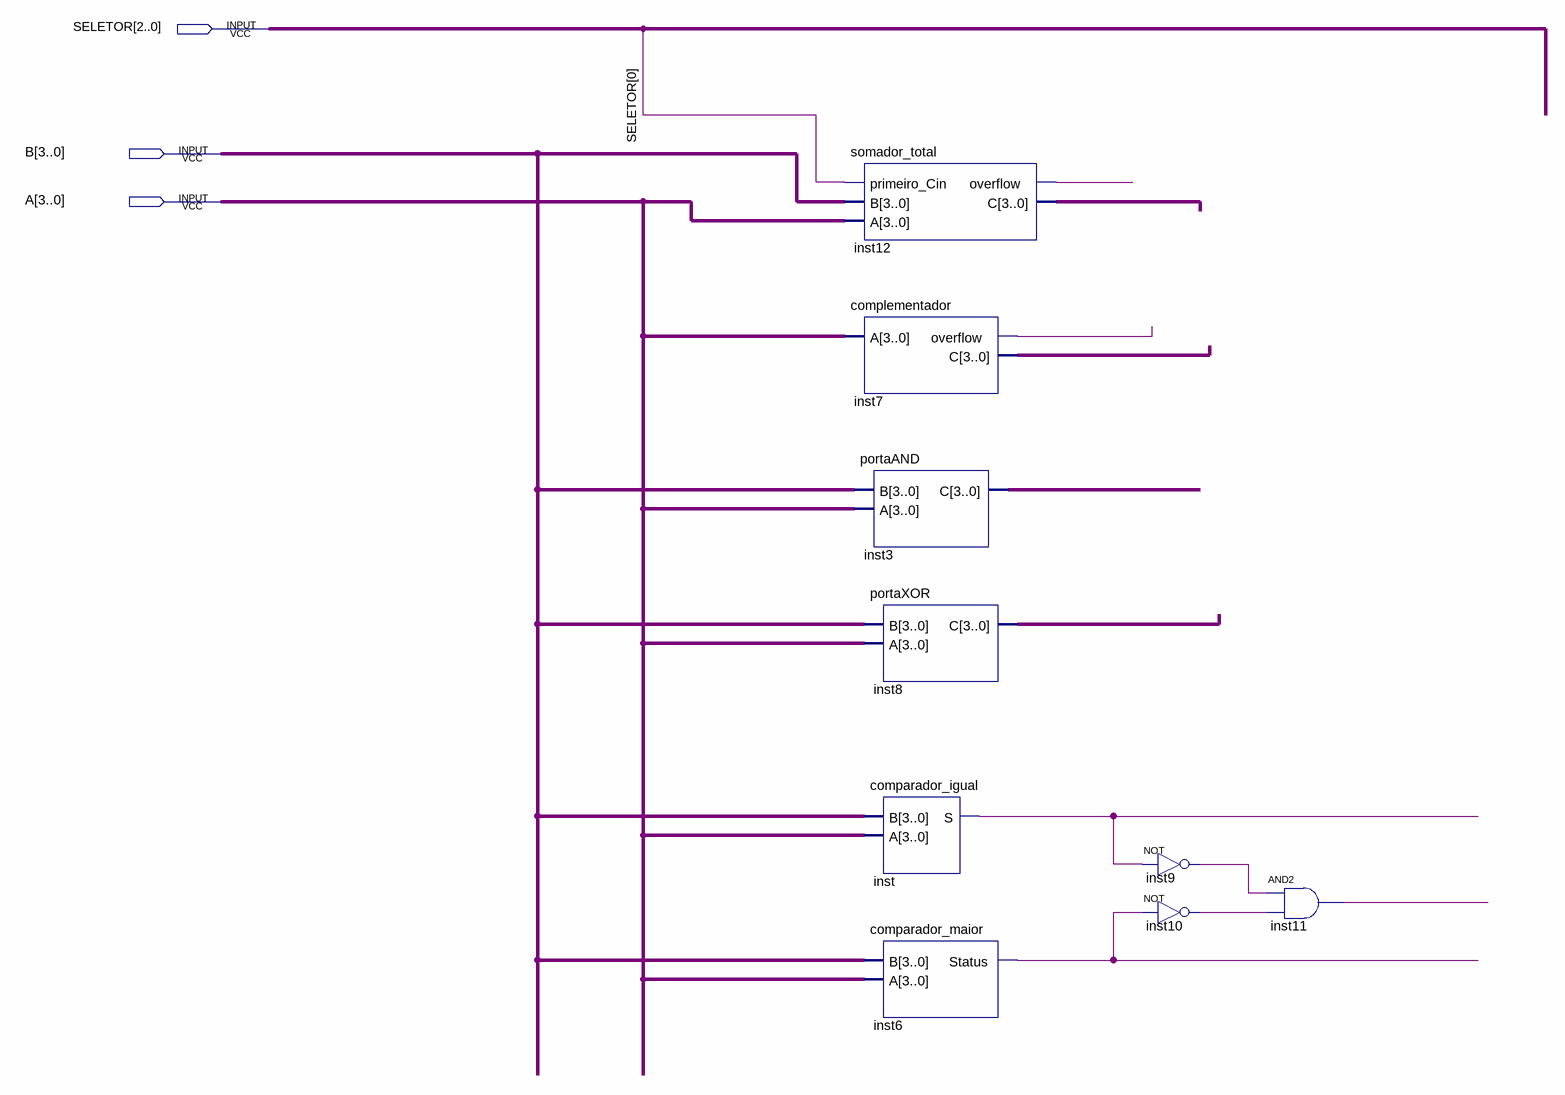
[diagram p0: schematic sheet]
// Quartus schematic ULA.bdf as structural Verilog: 9 symbols, 3 pins
module ULA (
  input  [2:0] SELETOR,
  input  [3:0] B,
  input  [3:0] A
);

  wire inst6_status, inst7_overflow, inst9_out, inst10_out, inst11_out, inst12_overflow, inst_s;
  wire [3:0] inst3_c, inst7_c, inst8_c, inst12_c;

  somador_total inst12 (.primeiro_Cin(SELETOR[0]), .B(B), .A(A), .overflow(inst12_overflow), .C(inst12_c));
  complementador inst7 (.A(A), .overflow(inst7_overflow), .C(inst7_c));
  portaAND inst3 (.B(B), .A(A), .C(inst3_c));
  portaXOR inst8 (.B(B), .A(A), .C(inst8_c));
  comparador_igual inst (.B(B), .A(A), .S(inst_s));
  comparador_maior inst6 (.B(B), .A(A), .Status(inst6_status));
  not inst9 (inst9_out, inst_s);
  not inst10 (inst10_out, inst6_status);
  and inst11 (inst11_out, inst9_out, inst10_out);
endmodule
